# Altium schematic sheet Industrial-Controller_Overview.SchDoc: Overview
size 279 x 215 mm; Date: not used; ApprovedBy: not used; CheckedBy: not used; Author: not used; DrawnBy: not used; Organization: not used; Address4: not used; SheetNumber: 1; SheetTotal: 21; Time: not used; ImagePath: not used; Application_BuildNumber: not used
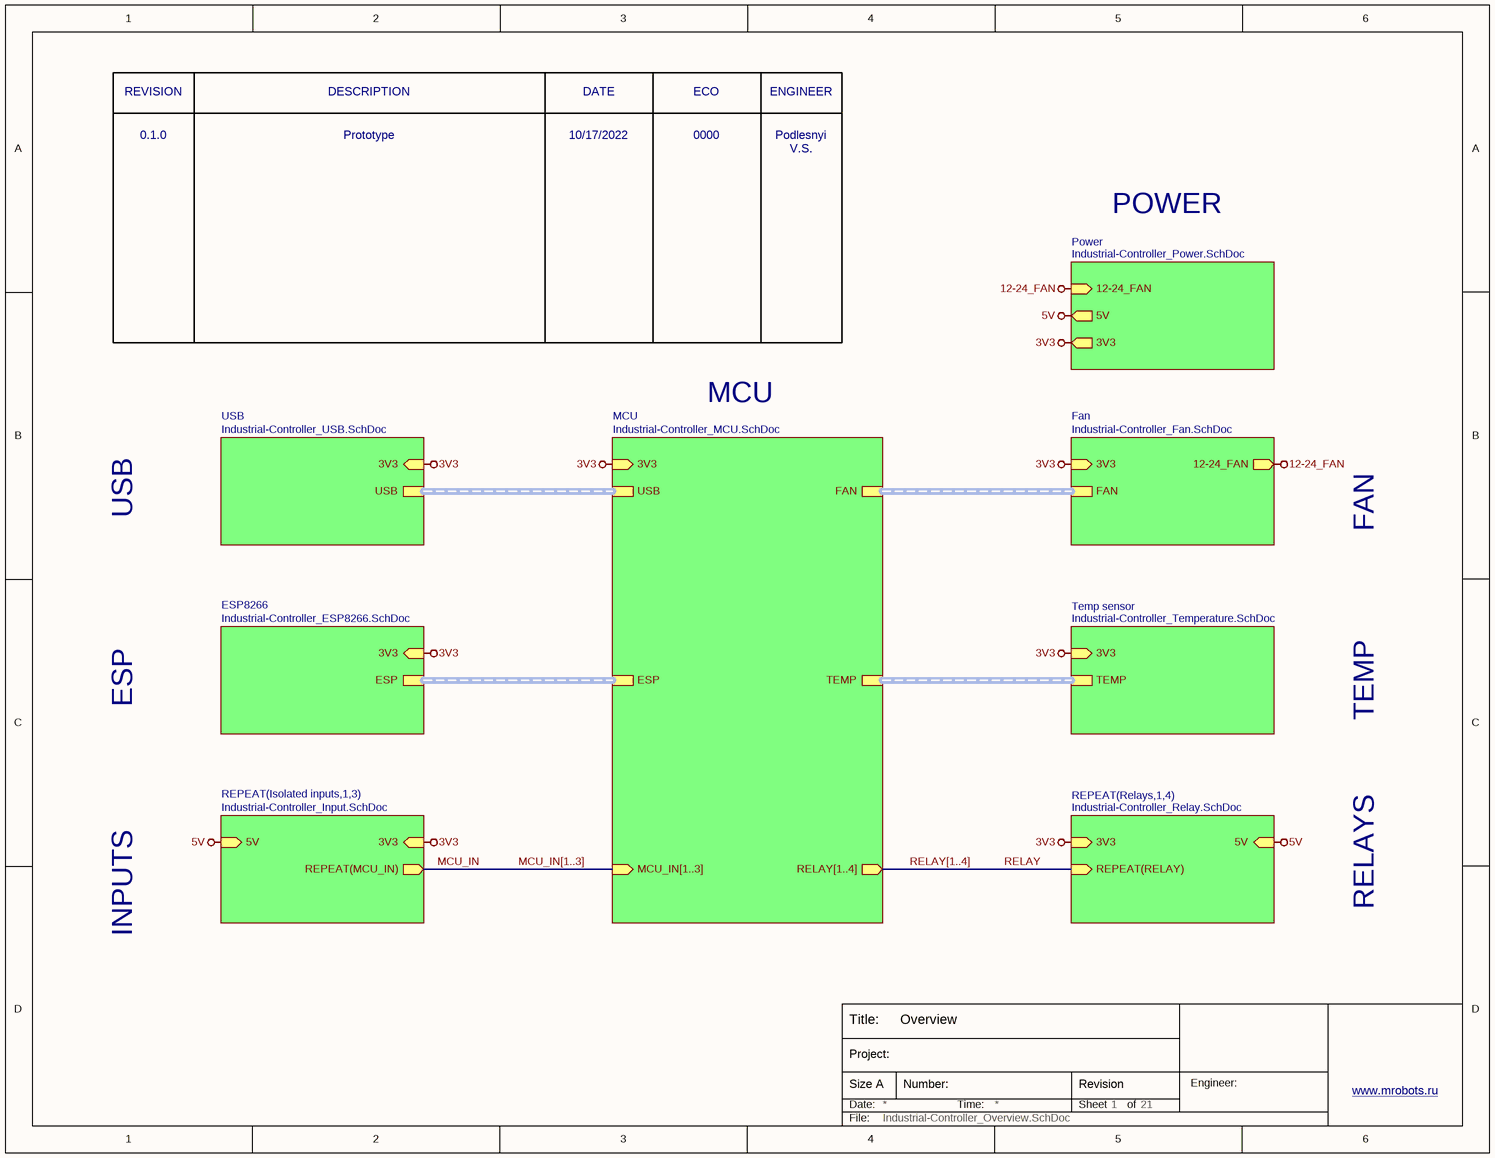
[diagram p0: Industrial-Controller_Overview.SchDoc]

## Sub-sheets
ESP8266 = Industrial-Controller_ESP8266.SchDoc: 3V3 (in), ESP (harness ESP)
Fan = Industrial-Controller_Fan.SchDoc: FAN (harness FAN), 3V3 (in), 12-24_FAN (out)
MCU = Industrial-Controller_MCU.SchDoc: 3V3 (in), ESP (harness ESP), TEMP (harness TEMP), USB (harness USB), FAN (harness FAN), MCU_IN[1..3] (in), RELAY[1..4] (out)
Power = Industrial-Controller_Power.SchDoc: 3V3 (out), 12-24_FAN (in), 5V (out)
REPEAT(Isolated inputs,1,3) = Industrial-Controller_Input.SchDoc: 3V3 (in), 5V (in), REPEAT(MCU_IN) (out)
REPEAT(Relays,1,4) = Industrial-Controller_Relay.SchDoc: 3V3 (in), REPEAT(RELAY) (in), 5V (in)
Temp sensor = Industrial-Controller_Temperature.SchDoc: TEMP (harness TEMP), 3V3 (in)
USB = Industrial-Controller_USB.SchDoc: 3V3 (in), USB (harness USB)

## Nets
3V3: sheet MCU/3V3, sheet Temp sensor/3V3, sheet USB/3V3, sheet ESP8266/3V3, sheet REPEAT(Isolated inputs,1,3)/3V3, sheet REPEAT(Relays,1,4)/3V3, sheet Fan/3V3, sheet Power/3V3
5V: sheet REPEAT(Isolated inputs,1,3)/5V, sheet REPEAT(Relays,1,4)/5V, sheet Power/5V
12-24_FAN: sheet Fan/12-24_FAN, sheet Power/12-24_FAN
MCU_IN: sheet REPEAT(Isolated inputs,1,3)/REPEAT(MCU_IN)
RELAY: sheet REPEAT(Relays,1,4)/REPEAT(RELAY)

## Buses and harness runs
bus MCU_IN[1..3] = sheet MCU/MCU_IN[1..3]
bus RELAY[1..4] = sheet MCU/RELAY[1..4]
harness sheet ESP8266/ESP = sheet MCU/ESP
harness sheet Fan/FAN = sheet MCU/FAN
harness sheet MCU/TEMP = sheet Temp sensor/TEMP
harness sheet MCU/USB = sheet USB/USB

## Notes on the sheet
- REVISION
- DESCRIPTION
- DATE
- ECO
- ENGINEER
- POWER
- 0.1.0
- Prototype
- 10/17/2022
- 0000
- Podlesnyi V.S.
- MCU
- USB
- FAN
- ESP
- TEMP
- RELAYS
- INPUTS
- Title:
- Date:
- Size A
- Project:
- Number:
- Time:
- Sheet
- Revision
- of
- Engineer:
- www.mrobots.ru <http://mrobots.ru/>
- File: